# EAGLE design FMB120_jigv3_00 (EAGLE 6.4)
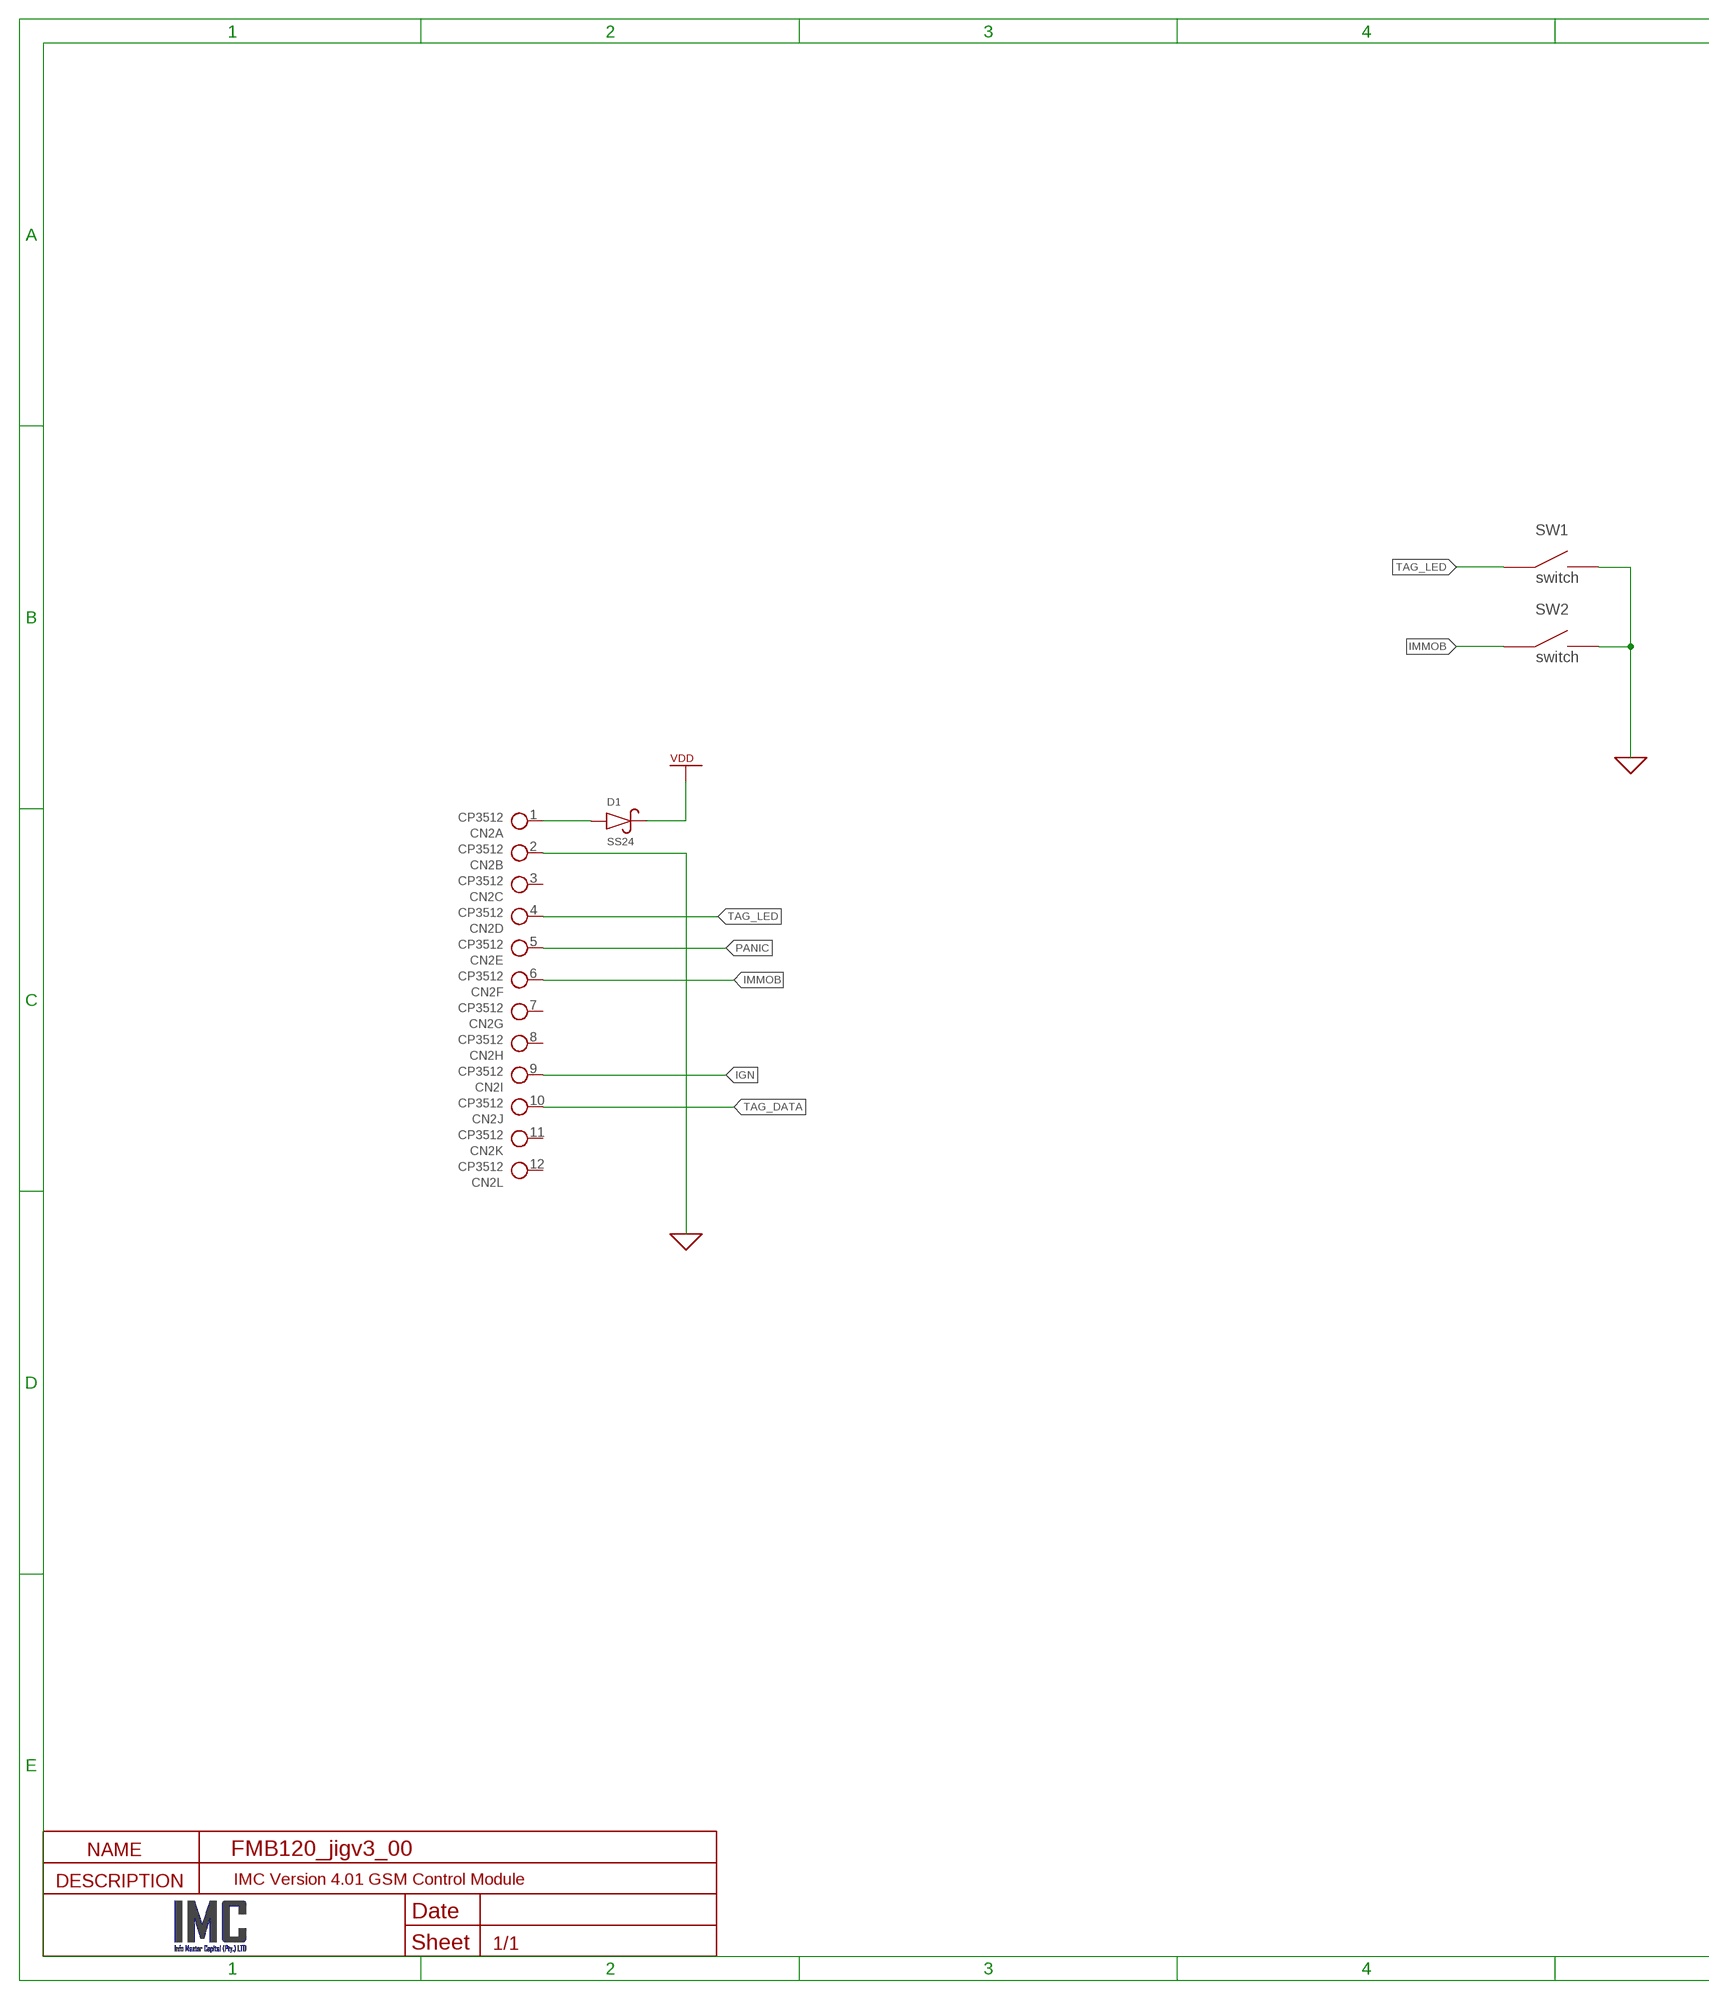
[diagram p0: schematic, sheet 1, part 1 of 2]
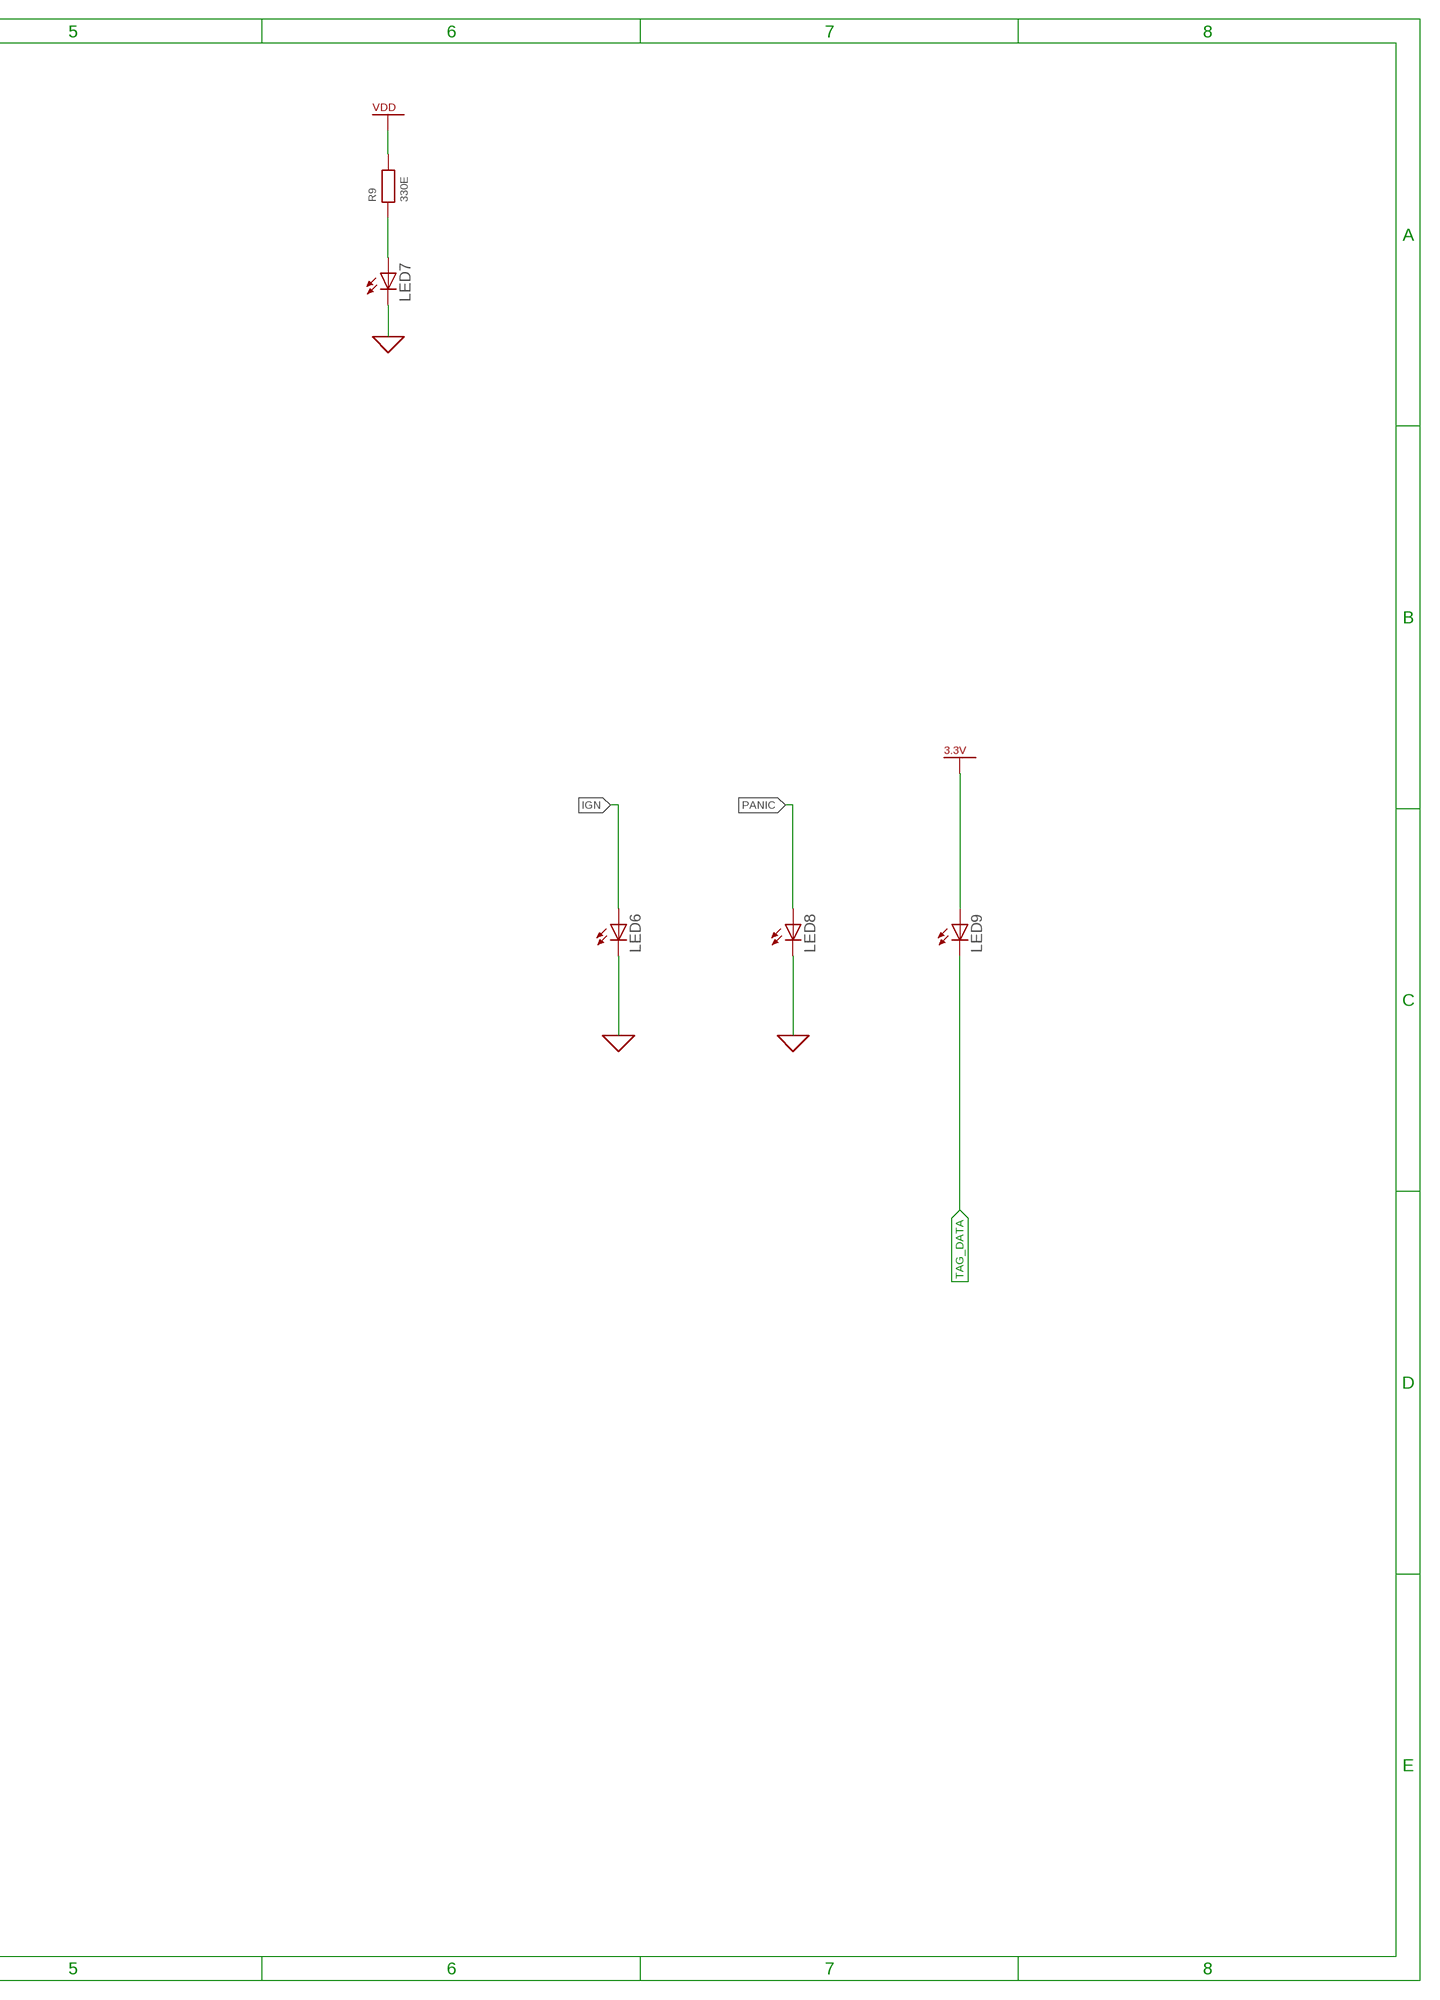
[diagram p1: schematic, sheet 1, part 2 of 2]

## Parts
CN2  CP3512  12-WAY_THRU_BLU  [CP3512_BLU]
D1  SS24  DIODE-SHOTKY_SS24  [SMB]
LED6  LED3MM  [LED3MM]
LED7  LED3MM  [LED3MM]
LED8  LED3MM  [LED3MM]
LED9  LED3MM  [LED3MM]
R9  330E  CHIP-RESISTOR_330E  [R0603]
SW1  switch  SWITCH_PM  [SIL_2]
SW2  switch  SWITCH_PM  [SIL_2]

## Nets
3.3V: LED9.A
GND: CN2.2 LED6.K(C) LED7.K(C) LED8.K(C) SW1.2 SW2.2
IGN: CN2.9 LED6.A
IMMOB: CN2.6 SW2.1
N$8: CN2.1 D1.A
N$20: LED7.A R9.1
PANIC: CN2.5 LED8.A
TAG_DATA: CN2.10 LED9.K(C)
TAG_LED: CN2.4 SW1.1
VDD: D1.C(K) R9.2
Unconnected: CN2.3 CN2.7 CN2.8 CN2.11 CN2.12

## Notes on the sheet
- IMC Version 4.01 GSM Control Module

## Library data of the parts
CN2 = Cellstop_Parts:12-WAY; VALUE: _thru_blu
D1 = Cellstop_Parts:DIODE-SHOTKY: Shotky Diode
LED6-LED9 = led:LED: LED OSRAM: - CHIPLED LG R971, LG N971, LY N971, LG Q971, LY Q971, LO R971, LY R971 LH N974, LH R974 LS Q976, LO Q976, LY Q976 LO Q996 - Hyper CHIPLED LW Q18S LB Q993, LB Q99A, LB R99A - SideLED LS A670, LO A670, LY A670, LG A670, LP A670 LB A673, LV A673, LT A673, LW A673 LH A674 LY A675 LS A676, LA A676, LO A676, LY A676, LW A676 LS A679, LY A679, LG A679 - Hyper Micro SIDELED® LS Y876, LA Y876, LO Y876, LY Y876 LT Y87S - SmartLED LW L88C, LW L88S LB L89C, LB L89S, LG L890 LS L89K, LO L89K, LY L89K LS L896, LA L896, LO L896, LY L896 - TOPLED LS T670, LO T670, LY T670, LG T670, LP T670 LSG T670, LSP T670, LSY T670, LOP T670, LYG T670 LG T671, LOG T671, LSG T671 LB T673, LV T673, LT T673, LW T673 LH T674 LS T676, LA T676, LO T676, LY T676, LB T676, LH T676, LSB T676, LW T676 LB T67C, LV T67C, LT T67C, LS T67K, LO T67K, LY T67K, LW E67C LS E67B, LA E67B, LO E67B, LY E67B, LB E67C, LV E67C, LT E67C LW T67C LS T679, LY T679, LG T679 LS T770, LO T770, LY T770, LG T770, LP T770 LB T773, LV T773, LT T773, LW T773 LH T774 LS E675, LA E675, LY E675, LS T675 LS T776, LA T776, LO T776, LY T776, LB T776 LHGB T686 LT T68C, LB T68C - Hyper Mini TOPLED® LB M676 - Mini TOPLED Santana® LG M470 LS M47K, LO M47K, LY M47K Source: http://www.osram.convergy.de LUXEON: - LUMILED® LXK2-PW12-R00, LXK2-PW12-S00, LXK2-PW14-U00, LXK2-PW14-V00 LXK2-PM12-R00, LXK2-PM12-S00, LXK2-PM14-U00 LXK2-PE12-Q00, LXK2-PE12-R00, LXK2-PE12-S00, LXK2-PE14-T00, LXK2-PE14-U00 LXK2-PB12-K00, LXK2-PB12-L00, LXK2-PB12-M00, LXK2-PB14-N00, LXK2-PB14-P00, LXK2-PB14-Q00 LXK2-PR12-L00, LXK2-PR12-M00, LXK2-PR14-Q00, LXK2-PR14-R00 LXK2-PD12-Q00, LXK2-PD12-R00, LXK2-PD12-S00 LXK2-PH12-R00, LXK2-PH12-S00 LXK2-PL12-P00, LXK2-PL12-Q00, LXK2-PL12-R00 Source: www.luxeon.com KINGBRIGHT: KA-3528ASYC Source: www.kingbright.com
R9 = resistors:CHIP-RESISTOR: Chip Resistor; SUPPLIER: Arrow Altech
SW1 SW2 = Cellstop_Parts:SWITCH

## Board
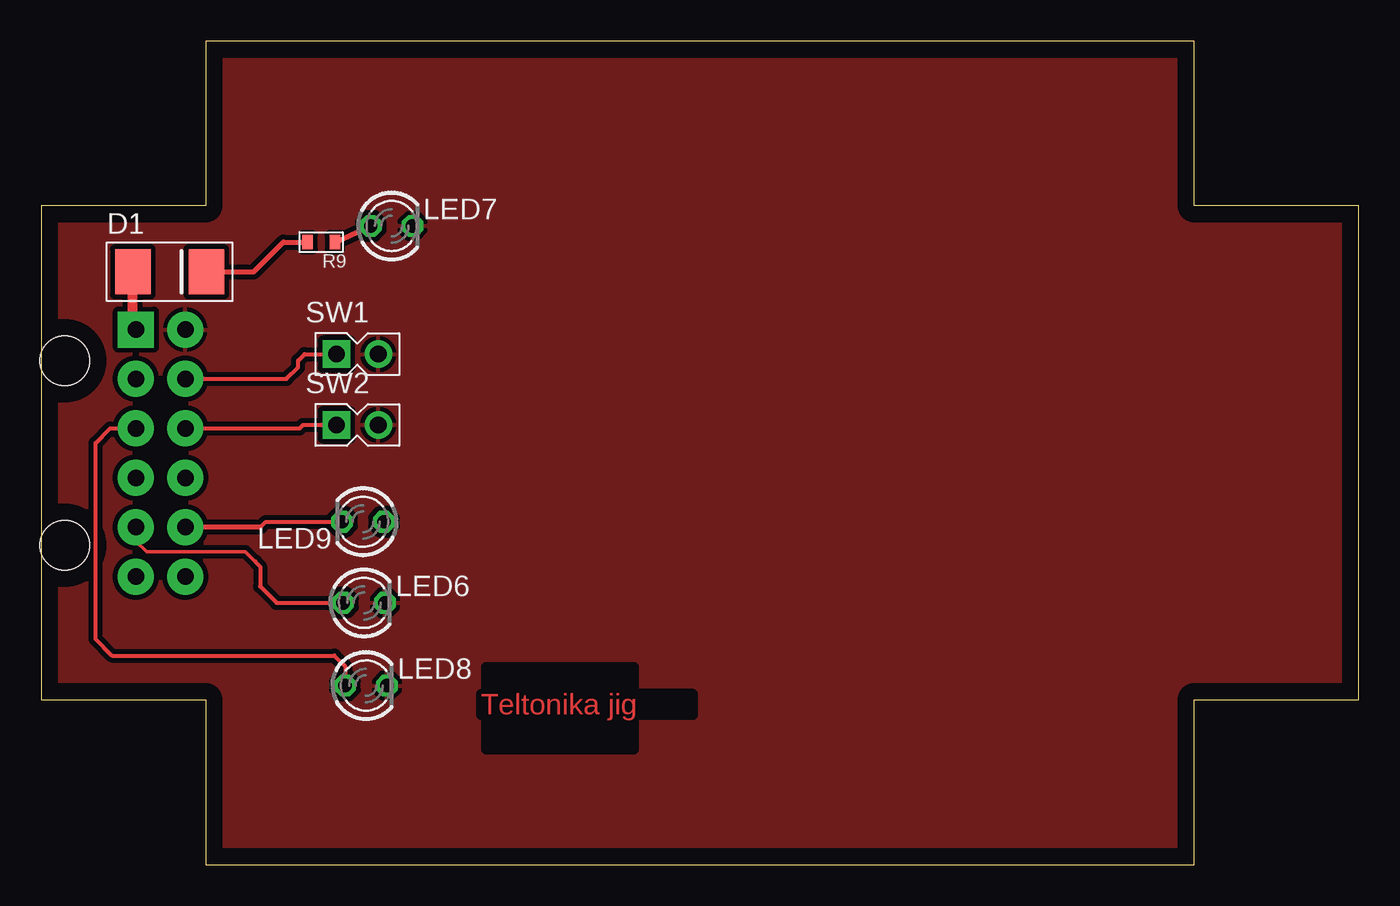
[diagram p2: board, top side]
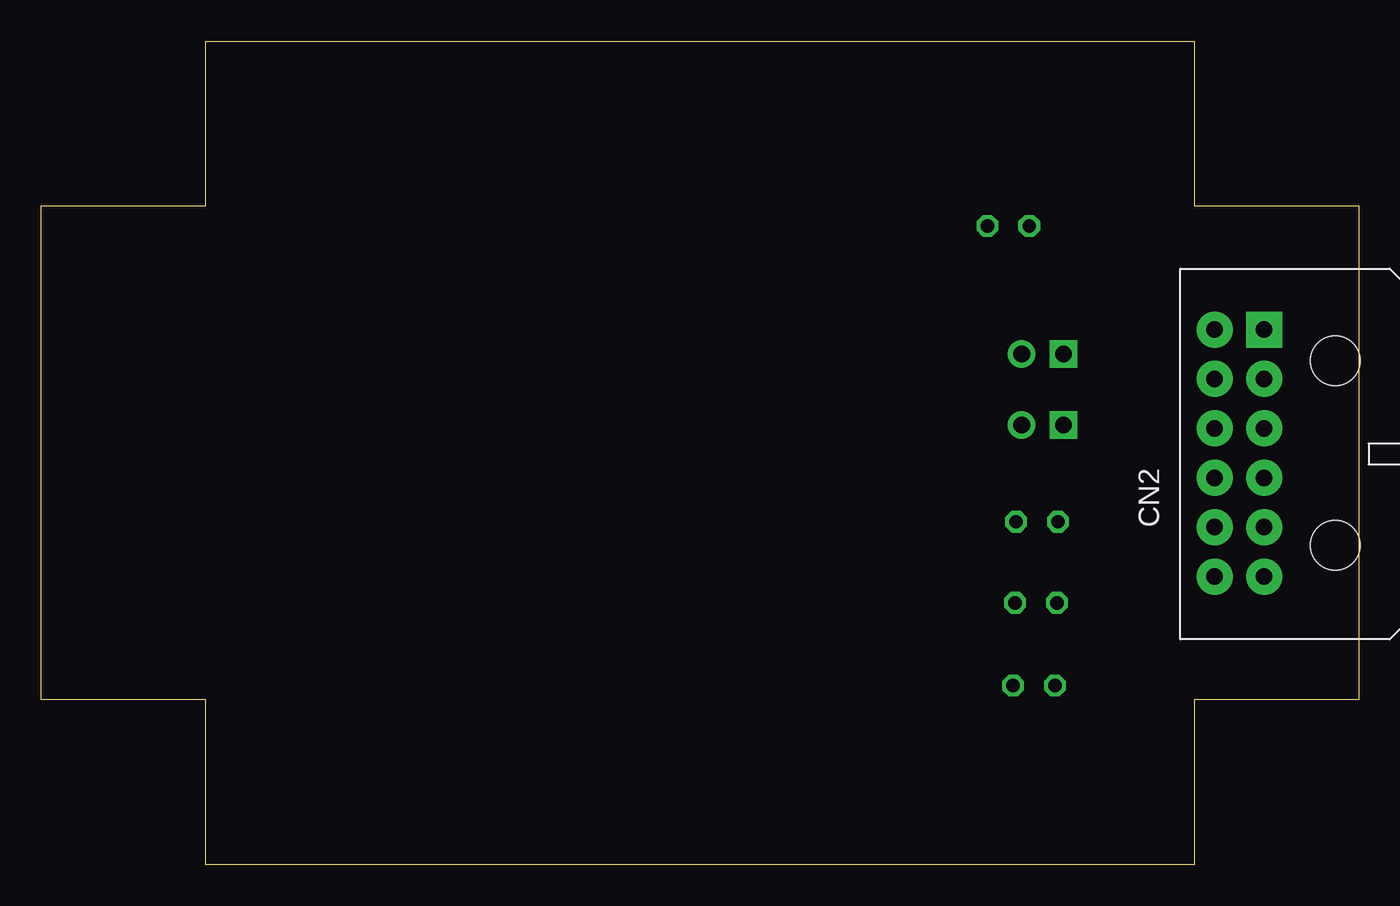
[diagram p3: board, bottom side, seen from below]

Size 80 x 50 mm. Coordinates in mm from the lower left corner, seen from the top.
Outline: 10,0 70,0 70,10 80,10 80,40 70,40 70,50 10,50 10,40 0,40 0,10 10,10 10,0
Copper layers (1*16): Top 0.035mm / dielectric 1.5mm / Bottom 0.035mm
Design rules "default": minimum track width 10mil, minimum drill 24mil, track to track 8mil, track to pad 8mil, pad to pad 8mil, via to via 8mil, smd to smd 8mil, copper to edge 40mil, drill to drill 8mil, minimum pad ring 10mil, minimum via ring 8mil, stop-mask expansion 4mil, vias tented up to drill 0mil, thermal gap 10mil
tRestrict: area 27,7 to 36,12

### Footprints (pad centres in the part's own frame; a part is rotated, then mirrored left to right if it is on the bottom)
CP3512_BLU = drill 1 pad 2.184 square: 1 12,0 | drill 1 pad 2.184: 2 12,3; 3 9,0; 4 9,3; 5 6,0; 6 6,3; 7 3,0; 8 3,3; 9 0,0; 10 0,3; 11 -3,0; 12 -3,3 | hole 3: -1.104,-4.325; 10.104,-4.325
SMB = smd 2.159 x 2.743: A -2.235,0; C 2.235,0
LED3MM = drill 0.813 octagon: A -1.27,0; K 1.27,0
R0603 = smd 0.635 x 0.889: 1 -0.826,0; 2 0.826,0
SIL_2 = drill 1.016 pad 1.676 square: 1 -1.27,0 | drill 1.016 pad 1.676: 2 1.27,0

### Placement (x,y rotation side)
CN2  5.75,20.49 90 bottom
D1  7.8,36 0 top
LED6  19.6,15.9 0 top
LED7  21.28,38.78 0 top
LED8  19.72,10.88 0 top
LED9  19.54,20.82 180 top
R9  17,37.8 180 top
SW1  19.2,31 0 top
SW2  19.2,26.7 0 top

### Tracks (layer width: path | path; a pad name or v marks a point on that pad's centre or on a via)
GND
  pour Top (isolate 0.305, rank 2): 0,40 0,10 10,10 10,0 70,0 70,10 80,10 80,40 70,40 70,50 10,50 10,40
IGN
  Top 0.2: 13,18.4 12.4,19 6.4,19 5.75,19.65 CN2.9
  Top 0.254: 13,18.4 13.3,18.1 13.3,16.9 14.3,15.9 LED6.A
IMMOB
  Top 0.254: CN2.6 15.69,26.49 15.9,26.7 SW2.1
N$8
  Top 0.61: CN2.1 5.57,32.67 D1.A
N$20
  Top 0.305: R9.1 17.85,37.78 LED7.A
PANIC
  Top 0.254: CN2.5 4.19,26.49 3.3,25.6 3.3,13.7 4.3,12.7 17.8,12.7 18.45,12.05 LED8.A
TAG_DATA
  Top 0.254: 13.31,20.49 13.64,20.82 LED9.K
  Top 0.305: 13.31,20.49 CN2.10
TAG_LED
  Top 0.254: CN2.4 14.89,29.49 15.6,30.2 15.6,30.6 16,31 SW1.1
VDD
  Top 0.305: D1.C 12.9,36 14.7,37.8 R9.2

### Text on the board
Top: Teltonika jig